# Altium schematic sheet Microphone.SchDoc
size A; SheetNumber: 6; SheetTotal: 6
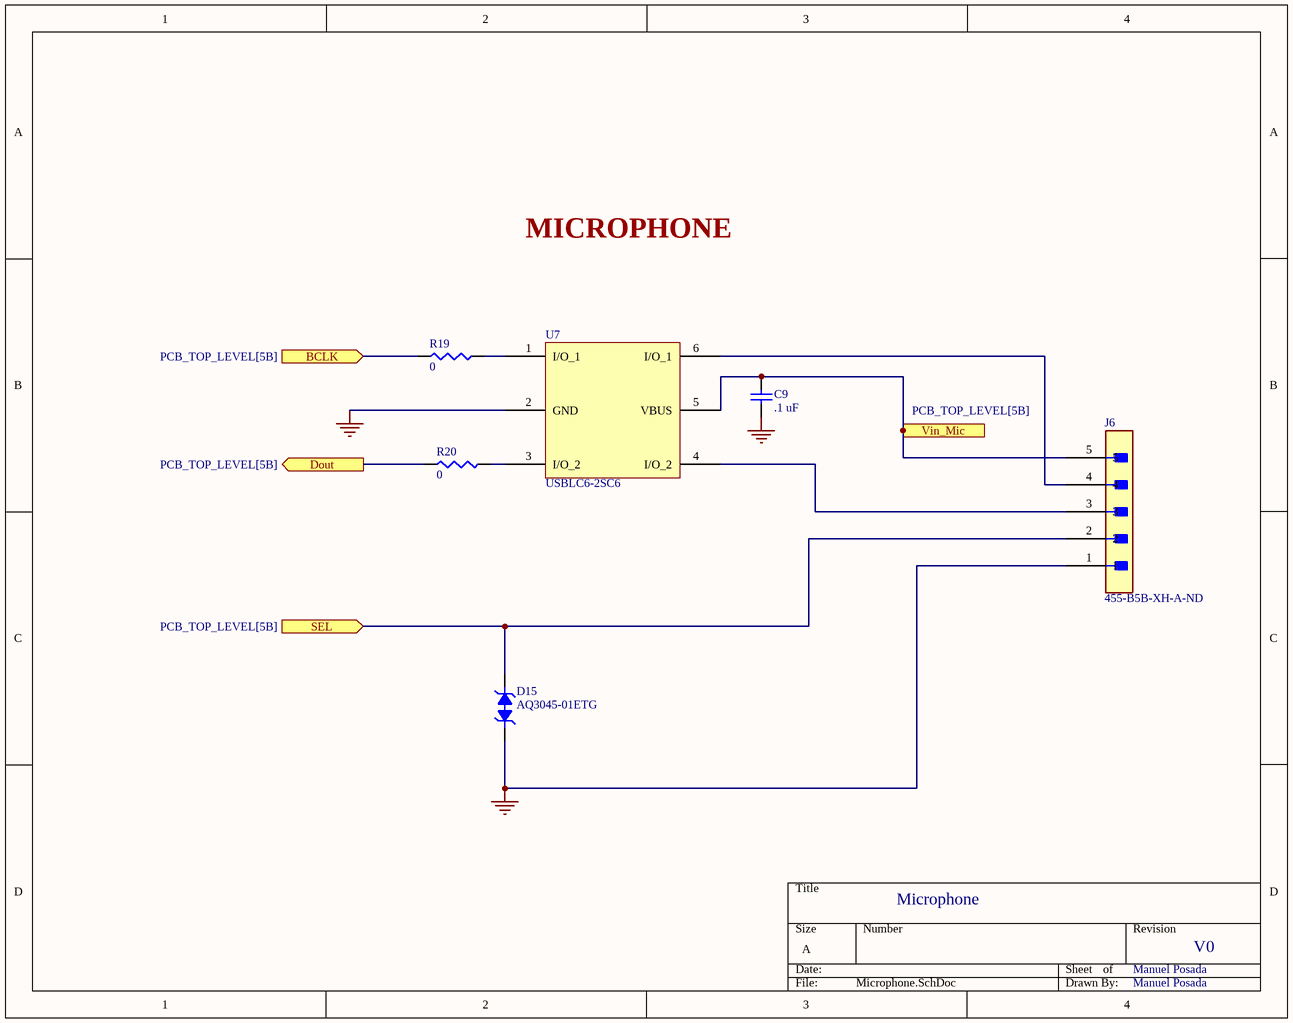
[diagram p0: Microphone.SchDoc]

## Parts
C9  .1 uF  [CAP_CL21_SAM-L]
D15  AQ3045-01ETG  [SOD882]
J6  455-B5B-XH-A-ND  [CONN_B5B-XH-A_JST]
R19  0  [RES_1220_SUS-L]
R20  0  [RES_1220_SUS-L]
U7  USBLC6-2SC6  [SOT23-6L_STM]

## Ports
BCLK (in, see PCB_TOP_LEVEL[5B]), Dout (out, see PCB_TOP_LEVEL[5B]), SEL (in, see PCB_TOP_LEVEL[5B]), Vin_Mic (in, see PCB_TOP_LEVEL[5B])

## Nets
GND: C9.1 D15.1 J6.1 U7.2(GND)
BCLK: R19.1 ; port BCLK
Dout: R20.1 ; port Dout
SEL: D15.2 J6.2 ; port SEL
Vin_Mic: C9.2 J6.5 U7.5(VBUS) ; port Vin_Mic
NetJ6_3: J6.3 U7.4(I/O_2)
NetJ6_4: J6.4 U7.6(I/O_1)
NetR19_2: R19.2 U7.1(I/O_1)
NetR20_2: R20.2 U7.3(I/O_2)

## Notes on the sheet
- MICROPHONE
- Microphone
- Manuel Posada
- V0

## Library data of the parts
C9 = CL21B104KBCNNNC: 50V 100nF X7R ±10% 0805 Multilayer Ceramic Capacitors MLCC - SMD/SMT ROHS; Manufacturer: Samsung Electro-Mechanics; Supplier: DigiKey; Supplier Part Number: 1276-1003-6-ND; Manufacturer Part Number: CL21B104KBCNNNC; RoHS: Compliant; Category: Ceramic Capacitors; Stock: 2859375; Pricing: 1=0.08, 10=0.006 (USD); Value: 100nF; Case/Package: 0805; Case Code (Imperial): 0805; Case Code (Metric): 2012; China RoHS: Compliant; Contact Plating: Tin; Country of Origin: Mainland China, Philippines, South Korea; Depth: 1.25mm; Dielectric: X7R; Dielectric Material: Ceramic; Export Control Classification Number (ECCN) Code: EAR99; Height: 950µm; Harmonized Tariff Schedule (HTS) Code: 8532.24.00.20; Introduction Date: 2009-07-27; Lead Free: Lead Free; Length: 2mm; Lifecycle Status: Production; Material: Ceramic; Max Operating Temperature: 125°C; Min Operating Temperature: -55°C; Mounting Technology: Surface Mount; Number of Terminals: 2; Radiation Hardening: No; REACH SVHC: Yes; Schedule B: 8532240020, 8532240020|8532240020, 8532240020|8532240020|8532240020, 8532240020|8532240020|8532240020|8532240020; Thickness: 939.8µm; Tolerance: 10%; Voltage: 50V; Voltage Rating: 50V; Voltage Rating (DC): 50V; Width: 1.25mm; ComponentLink1URL: https://datasheet.octopart.com:443/CL21B104KBCNNNC-Samsung-Electro-Mechanics-datasheet-137745078.pdf?src-supplier=IHS; ComponentLink1Description: https://datasheet.octopart.com:443/CL21B104KBCNNNC-Samsung-Electro-Mechanics-datasheet-137745078.pdf?src-supplier=IHS; ComponentLink2URL: https://datasheet.octopart.com/CL21B104KBCNNNC-Samsung-Electro-Mechanics-datasheet-8324245.pdf; ComponentLink2Description: https://datasheet.octopart.com/CL21B104KBCNNNC-Samsung-Electro-Mechanics-datasheet-8324245.pdf; ComponentLink3URL: https://datasheet.octopart.com/CL21B104KBCNNNC-Samsung-Electro-Mechanics-datasheet-97040617.pdf; ComponentLink3Description: https://datasheet.octopart.com/CL21B104KBCNNNC-Samsung-Electro-Mechanics-datasheet-97040617.pdf; ComponentLink4URL: https://datasheet.octopart.com:443/CL21B104KBCNNNC-Samsung-Electro-Mechanics-datasheet-11548950.pdf?src-supplier=Future+Electronics; ComponentLink4Description: https://datasheet.octopart.com:443/CL21B104KBCNNNC-Samsung-Electro-Mechanics-datasheet-11548950.pdf?src-supplier=Future+Electronics; ComponentLink5URL: https://datasheet.octopart.com:443/CL21B104KBCNNNC-Samsung-Electro-Mechanics-datasheet-116891032.pdf?src-supplier=Future+Electronics; ComponentLink5Description: https://datasheet.octopart.com:443/CL21B104KBCNNNC-Samsung-Electro-Mechanics-datasheet-116891032.pdf?src-supplier=Future+Electronics; ComponentLink6URL: https://datasheet.octopart.com:443/CL21B104KBCNNNC-Samsung-Electro-Mechanics-datasheet-81462175.pdf?src-supplier=Future+Electronics; ComponentLink6Description: https://datasheet.octopart.com:443/CL21B104KBCNNNC-Samsung-Electro-Mechanics-datasheet-81462175.pdf?src-supplier=Future+Electronics; ComponentLink7URL: https://datasheet.octopart.com:443/CL21B104KBCNNNC-Samsung-datasheet-42485244.pdf?src-supplier=Future+Electronics; ComponentLink7Description: https://datasheet.octopart.com:443/CL21B104KBCNNNC-Samsung-datasheet-42485244.pdf?src-supplier=Future+Electronics; ComponentLink8URL: https://datasheet.octopart.com:443/CL21B104KBCNNNC-Samsung-Electro-Mechanics-datasheet-149045937.pdf?src-supplier=Future+Electronics; ComponentLink8Description: https://datasheet.octopart.com:443/CL21B104KBCNNNC-Samsung-Electro-Mechanics-datasheet-149045937.pdf?src-supplier=Future+Electronics; ComponentLink9URL: https://datasheet.octopart.com:443/CL21B104KBCNNNC-Samsung-datasheet-8326407.pdf?src-supplier=TME; ComponentLink9Description: https://datasheet.octopart.com:443/CL21B104KBCNNNC-Samsung-datasheet-8326407.pdf?src-supplier=TME
D15 = AQ3045-01ETG: TVS DIODE 5.3VWM 12VC SOD882; Manufacturer: Littelfuse; Diode Element Material: SILICON; Package Body Material: Plastic; Polarity: Bidirectional; Max Breakdown Voltage: 9V; Min Breakdown Voltage: 6.8V; Diode Type: TRANS VOLTAGE SUPPRESSOR; Non-rep Peak Rev Power Dis-Max: 40W; Number of Elements: 1; Rep Pk Reverse Voltage-Max: 5.3V; Reference Standard: AEC-Q101; Supplier: Digikey; Supplier Part Number: F9321CT-ND; Manufacturer Part Number: AQ3045-01ETG; RoHS: Yes; Category: TVS Diodes; Stock: 21664; Pricing: 1=0.5, 10=0.391, 100=0.2344, 500=0.217, 1000=0.14756, 2000=0.13585, 5000=0.1302 (USD); Pins: 2; Package Shape: Rectangular; Min Operating Temperature: -55°C; Max Operating Temperature: 150°C; Package Style: CHIP CARRIERMeter; Surface Mount: Yes; Technology: AVALANCHE; Terminal Form: No Lead; Terminal Position: BOTTOM; Reach SVHC Compliant: Yes; RoHS Compliant: Yes; ComponentLink1URL: https://datasheet.ciiva.com:443/pdfs/VipMasterIC/IC/LFSI/LFSI-S-A0007892042/LFSI-S-A0007892042-1.pdf?src-supplier=IHS+Markit; ComponentLink1Description: https://datasheet.ciiva.com:443/pdfs/VipMasterIC/IC/LFSI/LFSI-S-A0007892042/LFSI-S-A0007892042-1.pdf?src-supplier=IHS+Markit; ComponentLink2URL: https://www.littelfuse.com/~/media/electronics/datasheets/tvs_diode_arrays/littelfuse_tvs_diode_array_aq3045_datasheet.pdf.pdf?src-supplier=Digikey; ComponentLink2Description: https://www.littelfuse.com/~/media/electronics/datasheets/tvs_diode_arrays/littelfuse_tvs_diode_array_aq3045_datasheet.pdf.pdf?src-supplier=Digikey; ComponentLink3URL: http://www.littelfuse.com/~/media/electronics/datasheets/tvs_diode_arrays/littelfuse_tvs_diode_array_aq3045_datasheet.pdf.pdf?src-supplier=Digikey; ComponentLink3Description: http://www.littelfuse.com/~/media/electronics/datasheets/tvs_diode_arrays/littelfuse_tvs_diode_array_aq3045_datasheet.pdf.pdf?src-supplier=Digikey; LCSC Part Number: C3710326
J6 = B5B-XH-A: Board Connector, 5 Contact(s), 1 Row(s), Male, Straight, 0.098 inch Pitch, Solder Terminal; Manufacturer: JST; Contact Resistance: 20mΩ; Current Rating: 3A; Insulation Resistance: 1GΩ; Supplier: DigiKey; Supplier Part Number: 455-B5B-XH-A-ND; Manufacturer Part Number: B5B-XH-A; RoHS: Compliant; Category: Card Edge Connectors; Stock: 112530; Pricing: 1=0.17, 10=0.144, 100=0.1225, 500=0.10932, 1000=0.10409, 5000=0.0929, 10000=0.08847 (USD); Contact Gender: Male; Contact Material: Bronze, Tin; Export Control Classification Number (ECCN) Code: EAR99; Housing Material: Nylon; Harmonized Tariff Schedule (HTS) Code: 8536.69.40.40; Introduction Date: 1997-11-01; Lifecycle Status: Production; Max Operating Temperature: 85°C; Min Operating Temperature: -25°C; Pins: 5; Number of Rows: 1; Orientation: Straight; Terminal Pitch: 2.5mm; ComponentLink1URL: https://datasheet.octopart.com:443/B5B-XH-A-JST-datasheet-157850277.pdf?src-supplier=IHS; ComponentLink1Description: https://datasheet.octopart.com:443/B5B-XH-A-JST-datasheet-157850277.pdf?src-supplier=IHS; ComponentLink2URL: https://datasheet.octopart.com:443/B5B-XH-A-JST-datasheet-10026044.pdf?src-supplier=TME; ComponentLink2Description: https://datasheet.octopart.com:443/B5B-XH-A-JST-datasheet-10026044.pdf?src-supplier=TME
R19 R20 = RC0805JR-070RL: GENERAL PURPOSE CHIP RESISTOR Metal Glaze/thick Film, 0.125W, 0ohm, Surface Mount, 0805; Manufacturer: Yageo Group; Power Dissipation: 125mW; Value: 0Ω; Temperature Coefficient: 300ppm/°C; Tolerance: 5%; Voltage Rating: 150V; Supplier: DigiKey; Supplier Part Number: 311-0.0ARDKR-ND; Manufacturer Part Number: RC0805JR-070RL; RoHS: Compliant; Category: Chip SMD Resistors; Stock: 1260777; Pricing: 1=0.1, 10=0.015, 25=0.0128, 50=0.011, 100=0.0097, 250=0.00812, 500=0.00716, 1000=0.00633 (USD); Case/Package: 0805; Case Code (Imperial): 0805; China RoHS: Non-Compliant; Composition: Thick Film; Contact Plating: Tin; Depth: 1.25mm; Height: 500µm; Lead Free: Lead Free; Length: 2mm; Lifecycle Status: Production; Max Operating Temperature: 155°C; Military Standard: Not; Min Operating Temperature: -55°C; Mounting Technology: Surface Mount; Pins: 2; Number of Terminals: 2; Packaging: Tape & Reel; Power Rating: 125mW; Radiation Hardening: No; REACH SVHC: Yes; Schedule B: 8533290000, 8533290000|8533290000, 8533290000|8533290000|8533290000, 8533290000|8533290000|8533290000|8533290000; Termination: SMD/SMT; Voltage Rating (DC): 150V; Width: 1.25mm; ComponentLink1URL: https://datasheet.octopart.com:443/RC0805JR-070RL-Yageo-datasheet-182189538.pdf?src-supplier=IHS; ComponentLink1Description: https://datasheet.octopart.com:443/RC0805JR-070RL-Yageo-datasheet-182189538.pdf?src-supplier=IHS; ComponentLink2URL: https://datasheet.octopart.com:443/RC0805JR-070RL-Yageo-datasheet-103092701.pdf?src-supplier=Upverter; ComponentLink2Description: https://datasheet.octopart.com:443/RC0805JR-070RL-Yageo-datasheet-103092701.pdf?src-supplier=Upverter; ComponentLink3URL: https://datasheet.octopart.com:443/RC0805JR-070RL-Yageo-datasheet-98239111.pdf?src-supplier=Upverter; ComponentLink3Description: https://datasheet.octopart.com:443/RC0805JR-070RL-Yageo-datasheet-98239111.pdf?src-supplier=Upverter; ComponentLink4URL: https://datasheet.octopart.com:443/RC0805JR-070RL-Yageo-datasheet-8330313.pdf?src-supplier=Newark; ComponentLink4Description: https://datasheet.octopart.com:443/RC0805JR-070RL-Yageo-datasheet-8330313.pdf?src-supplier=Newark; ComponentLink5URL: https://datasheet.octopart.com:443/RC0805JR-070RL-Yageo-datasheet-8327506.pdf?src-supplier=Newark; ComponentLink5Description: https://datasheet.octopart.com:443/RC0805JR-070RL-Yageo-datasheet-8327506.pdf?src-supplier=Newark; ComponentLink6URL: https://datasheet.octopart.com:443/RC0805JR-070RL-Yageo-datasheet-62067350.pdf?src-supplier=element14+APAC; ComponentLink6Description: https://datasheet.octopart.com:443/RC0805JR-070RL-Yageo-datasheet-62067350.pdf?src-supplier=element14+APAC; ComponentLink7URL: https://datasheet.octopart.com:443/RC0805JR-070RL-Yageo-datasheet-17879891.pdf?src-supplier=element14+APAC; ComponentLink7Description: https://datasheet.octopart.com:443/RC0805JR-070RL-Yageo-datasheet-17879891.pdf?src-supplier=element14+APAC; ComponentLink8URL: https://datasheet.octopart.com:443/RC0805JR-070RL-Yageo-Group-datasheet-176638170.pdf?src-supplier=Future+Electronics; ComponentLink8Description: https://datasheet.octopart.com:443/RC0805JR-070RL-Yageo-Group-datasheet-176638170.pdf?src-supplier=Future+Electronics; ComponentLink9URL: https://datasheet.octopart.com:443/RC0805JR-070RL-Yageo-datasheet-164759695.pdf?src-supplier=Future+Electronics; ComponentLink9Description: https://datasheet.octopart.com:443/RC0805JR-070RL-Yageo-datasheet-164759695.pdf?src-supplier=Future+Electronics; ComponentLink10URL: https://datasheet.octopart.com:443/RC0805JR-070RL-Yageo-datasheet-15800360.pdf?src-supplier=Future+Electronics; ComponentLink10Description: https://datasheet.octopart.com:443/RC0805JR-070RL-Yageo-datasheet-15800360.pdf?src-supplier=Future+Electronics; ComponentLink11URL: https://datasheet.octopart.com:443/RC0805JR-070RL-Yageo-datasheet-12592811.pdf?src-supplier=Future+Electronics; ComponentLink11Description: https://datasheet.octopart.com:443/RC0805JR-070RL-Yageo-datasheet-12592811.pdf?src-supplier=Future+Electronics; ComponentLink12URL: https://datasheet.octopart.com:443/RC0805JR-070RL-Yageo-datasheet-8324252.pdf?src-supplier=Future+Electronics; ComponentLink12Description: https://datasheet.octopart.com:443/RC0805JR-070RL-Yageo-datasheet-8324252.pdf?src-supplier=Future+Electronics; ComponentLink13URL: https://datasheet.octopart.com:443/RC0805JR-070RL-Yageo-datasheet-79472498.pdf?src-supplier=Megastar; ComponentLink13Description: https://datasheet.octopart.com:443/RC0805JR-070RL-Yageo-datasheet-79472498.pdf?src-supplier=Megastar; ComponentLink14URL: https://datasheet.octopart.com/RC0805JR-070RL-Yageo-datasheet-73766026.pdf; ComponentLink14Description: https://datasheet.octopart.com/RC0805JR-070RL-Yageo-datasheet-73766026.pdf; ComponentLink15URL: https://datasheet.octopart.com:443/RC0805JR-070RL-Yageo-datasheet-8377918.pdf?src-supplier=Farnell; ComponentLink15Description: https://datasheet.octopart.com:443/RC0805JR-070RL-Yageo-datasheet-8377918.pdf?src-supplier=Farnell; ComponentLink16URL: https://datasheet.octopart.com:443/RC0805JR-070RL-Yageo-datasheet-118657.pdf?src-supplier=DigiKey; ComponentLink16Description: https://datasheet.octopart.com:443/RC0805JR-070RL-Yageo-datasheet-118657.pdf?src-supplier=DigiKey; ComponentLink17URL: http://sigma.octopart.com:80/conflict_mineral_statement/Yageo-company-3.pdf?src-supplier=Compliance+Statements; ComponentLink17Description: http://sigma.octopart.com:80/conflict_mineral_statement/Yageo-company-3.pdf?src-supplier=Compliance+Statements; ComponentLink18URL: http://sigma.octopart.com:80/rohs_statement/Yageo-company-2.pdf?src-supplier=Compliance+Statements; ComponentLink18Description: http://sigma.octopart.com:80/rohs_statement/Yageo-company-2.pdf?src-supplier=Compliance+Statements
U7 = USBLC6-2SC6: 17V Clamp 5A (8/20µs) Ipp Tvs Diode Surface Mount SOT-23-6; Manufacturer: STMicroelectronics; Breakdown Voltage: 6V; Value: 2.5pF; Data Rate: 480Mbps; Direction: Unidirectional; Element Configuration: Dual; ESD Protection: Yes; Forward Voltage: 1.1V; Leakage Current: 150nA; Max Junction Temperature (Tj): 125°C; Max Repetitive Reverse Voltage (Vrrm): 5.25V; Number of Bidirectional Channels: 2; Number of Elements: 1; Reverse Standoff Voltage: 5V; Test Current: 1mA; Supplier: DigiKey; Supplier Part Number: 497-5235-1-ND; Manufacturer Part Number: USBLC6-2SC6; RoHS: Compliant; Category: TVS Diodes; Stock: 229189; Pricing: 1=0.36, 10=0.243, 100=0.163, 500=0.127, 1000=0.114, 3000=0.077, 6000=0.076, 9000=0.075 (USD); Case/Package: SOT-23; China RoHS: Compliant; Clamping Voltage: 17V; Contact Plating: Tin; Country of Origin: Mainland China; Depth: 1.75mm; Export Control Classification Number (ECCN) Code: EAR99; Height: 1.45mm; Harmonized Tariff Schedule (HTS) Code: 8541.10.00.50; Introduction Date: 2005-03-15; Lead Free: Lead Free; Length: 3.05mm; Lifecycle Status: Production; Max Breakdown Voltage: 6V; Max Operating Temperature: 125°C; Max Reverse Leakage Current: 150nA; Min Breakdown Voltage: 6V; Min Operating Temperature: -40°C; Mounting Technology: Surface Mount; Number of Channels: 2; Pins: 6; Number of Terminals: 6; Operating Supply Voltage: 1.1V; Peak Pulse Current: 5A; Peak Reverse Current: 150nA; Polarity: Unidirectional; Power Line Protection: Yes; Radiation Hardening: No; REACH SVHC: Yes; Reverse Breakdown Voltage: 6V; Schedule B: 8536300000, 8536300000|8536300000|8536300000|8536300000|8536300000|8536300000|8536300000|8536300000|8536300000|8536300000|8536300000|8536300000|8536300000|8536300000|8536300000|8536300000|8536300000|8536300000|8536300000|8536300000|8536300000|8536300000|8536300000|85; Termination: SMD/SMT; Width: 1.75mm; Working Voltage: 5V; ComponentLink1URL: https://datasheet.octopart.com:443/USBLC6-2SC6-STMicroelectronics-datasheet-10412581.pdf?src-supplier=Newark; ComponentLink1Description: https://datasheet.octopart.com:443/USBLC6-2SC6-STMicroelectronics-datasheet-10412581.pdf?src-supplier=Newark; ComponentLink2URL: https://datasheet.octopart.com:443/USBLC6-2SC6-STMicroelectronics-datasheet-181961833.pdf?src-supplier=Newark; ComponentLink2Description: https://datasheet.octopart.com:443/USBLC6-2SC6-STMicroelectronics-datasheet-181961833.pdf?src-supplier=Newark; ComponentLink3URL: https://datasheet.octopart.com:443/USBLC6-2SC6-STMicroelectronics-datasheet-525477.pdf?src-supplier=Factory+Futures; ComponentLink3Description: https://datasheet.octopart.com:443/USBLC6-2SC6-STMicroelectronics-datasheet-525477.pdf?src-supplier=Factory+Futures; ComponentLink4URL: https://datasheet.octopart.com:443/USBLC6-2SC6-STMicroelectronics-datasheet-82998616.pdf?src-supplier=Farnell; ComponentLink4Description: https://datasheet.octopart.com:443/USBLC6-2SC6-STMicroelectronics-datasheet-82998616.pdf?src-supplier=Farnell; ComponentLink5URL: https://datasheet.octopart.com:443/USBLC6-2SC6-STMicroelectronics-datasheet-46285.pdf?src-supplier=Farnell; ComponentLink5Description: https://datasheet.octopart.com:443/USBLC6-2SC6-STMicroelectronics-datasheet-46285.pdf?src-supplier=Farnell; ComponentLink6URL: https://datasheet.octopart.com:443/USBLC6-2SC6-STMicroelectronics-datasheet-14050643.pdf?src-supplier=iiiC; ComponentLink6Description: https://datasheet.octopart.com:443/USBLC6-2SC6-STMicroelectronics-datasheet-14050643.pdf?src-supplier=iiiC; ComponentLink7URL: https://datasheet.octopart.com:443/USBLC6-2SC6-STMicroelectronics-datasheet-10521292.pdf?src-supplier=Jameco; ComponentLink7Description: https://datasheet.octopart.com:443/USBLC6-2SC6-STMicroelectronics-datasheet-10521292.pdf?src-supplier=Jameco